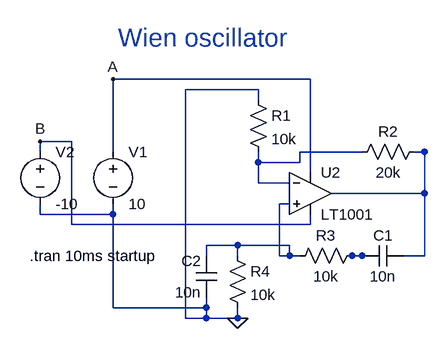
[diagram p0: schematic Wien-oscillator.asc]
Wien-oscillator.asc, the LTspice schematic file:
Version 4.1
SHEET 1 880 680
WIRE 0 336 0 352
WIRE 80 32 80 16
WIRE 48 352 48 368
WIRE -144 192 -144 208
WIRE -256 192 -256 208
WIRE 0 352 0 368
WIRE 0 368 48 368
WIRE 0 352 -144 352
WIRE -144 352 -144 208
WIRE -144 208 -256 208
WIRE 48 368 -32 368
WIRE -32 368 -32 16
WIRE -32 16 80 16
FLAG 48 368 0
WIRE 160 144 160 128
WIRE -144 112 -144 96
WIRE 160 128 160 0
WIRE 160 0 -144 0
WIRE -144 0 -144 96
FLAG -144 0 A
WIRE 160 208 160 224
WIRE -256 112 -256 96
WIRE 160 224 -208 224
WIRE -208 224 -208 96
WIRE -208 96 -256 96
FLAG -256 96 B
WIRE 80 112 80 128
WIRE 240 112 224 112
WIRE 128 160 112 160
WIRE 80 128 80 160
WIRE 80 160 112 160
WIRE 80 128 144 128
WIRE 144 128 144 112
WIRE 144 112 224 112
WIRE 304 272 320 272
WIRE 320 112 336 112
WIRE 192 176 208 176
WIRE 320 272 336 272
WIRE 336 272 336 112
WIRE 336 112 336 176
WIRE 336 176 208 176
WIRE 0 272 0 256
WIRE 144 272 128 272
WIRE 48 272 48 256
WIRE 128 192 112 192
WIRE 0 256 48 256
WIRE 48 256 128 256
WIRE 128 256 128 272
WIRE 128 272 112 272
WIRE 112 272 112 192
WIRE 240 272 224 272
WIRE 224 272 240 272
SYMBOL res 64 16 R0
SYMATTR InstName R1
SYMATTR Value 10k
SYMBOL res 336 96 R90
WINDOW 0 0 56 VBottom 2
WINDOW 3 32 56 VTop 2
SYMATTR InstName R2
SYMATTR Value 20k
SYMBOL res 240 256 R90
WINDOW 0 0 56 VBottom 2
WINDOW 3 32 56 VTop 2
SYMATTR InstName R3
SYMATTR Value 10k
SYMBOL cap 304 256 R90
WINDOW 0 0 32 VBottom 2
WINDOW 3 32 32 VTop 2
SYMATTR InstName C1
SYMATTR Value 10n
SYMBOL cap 16 336 R180
WINDOW 0 24 56 Left 2
WINDOW 3 24 8 Left 2
SYMATTR InstName C2
SYMATTR Value 10n
SYMBOL res 32 256 R0
SYMATTR InstName R4
SYMATTR Value 10k
SYMBOL voltage -144 96 R0
WINDOW 123 0 0 Left 2
WINDOW 39 0 0 Left 2
SYMATTR InstName V1
SYMATTR Value 10
SYMBOL Opamps\\LT1001 160 112 R0
SYMATTR InstName U2
SYMBOL voltage -256 96 R0
WINDOW 123 0 0 Left 2
WINDOW 39 0 0 Left 2
SYMATTR InstName V2
SYMATTR Value -10
TEXT -272 272 Left 2 !.tran 10ms startup
TEXT -136 -64 Left 4 ;Wien oscillator

The netlist it stands for:
* Wien-oscillator.asc
R1 0 N001 10k
R2 N002 N001 20k
R3 N004 N003 10k
C1 N002 N004 10n
C2 0 N003 10n
R4 N003 0 10k
V1 A 0 10
X§U2 N003 N001 A B N002 LT1001  ; pins In+ In- V+ V- OUT
V2 B 0 -10
.tran 10ms startup
* Wien oscillator
.lib LTC.lib
.backanno
.end